# EAGLE design AVR-Doper (EAGLE 4.16)
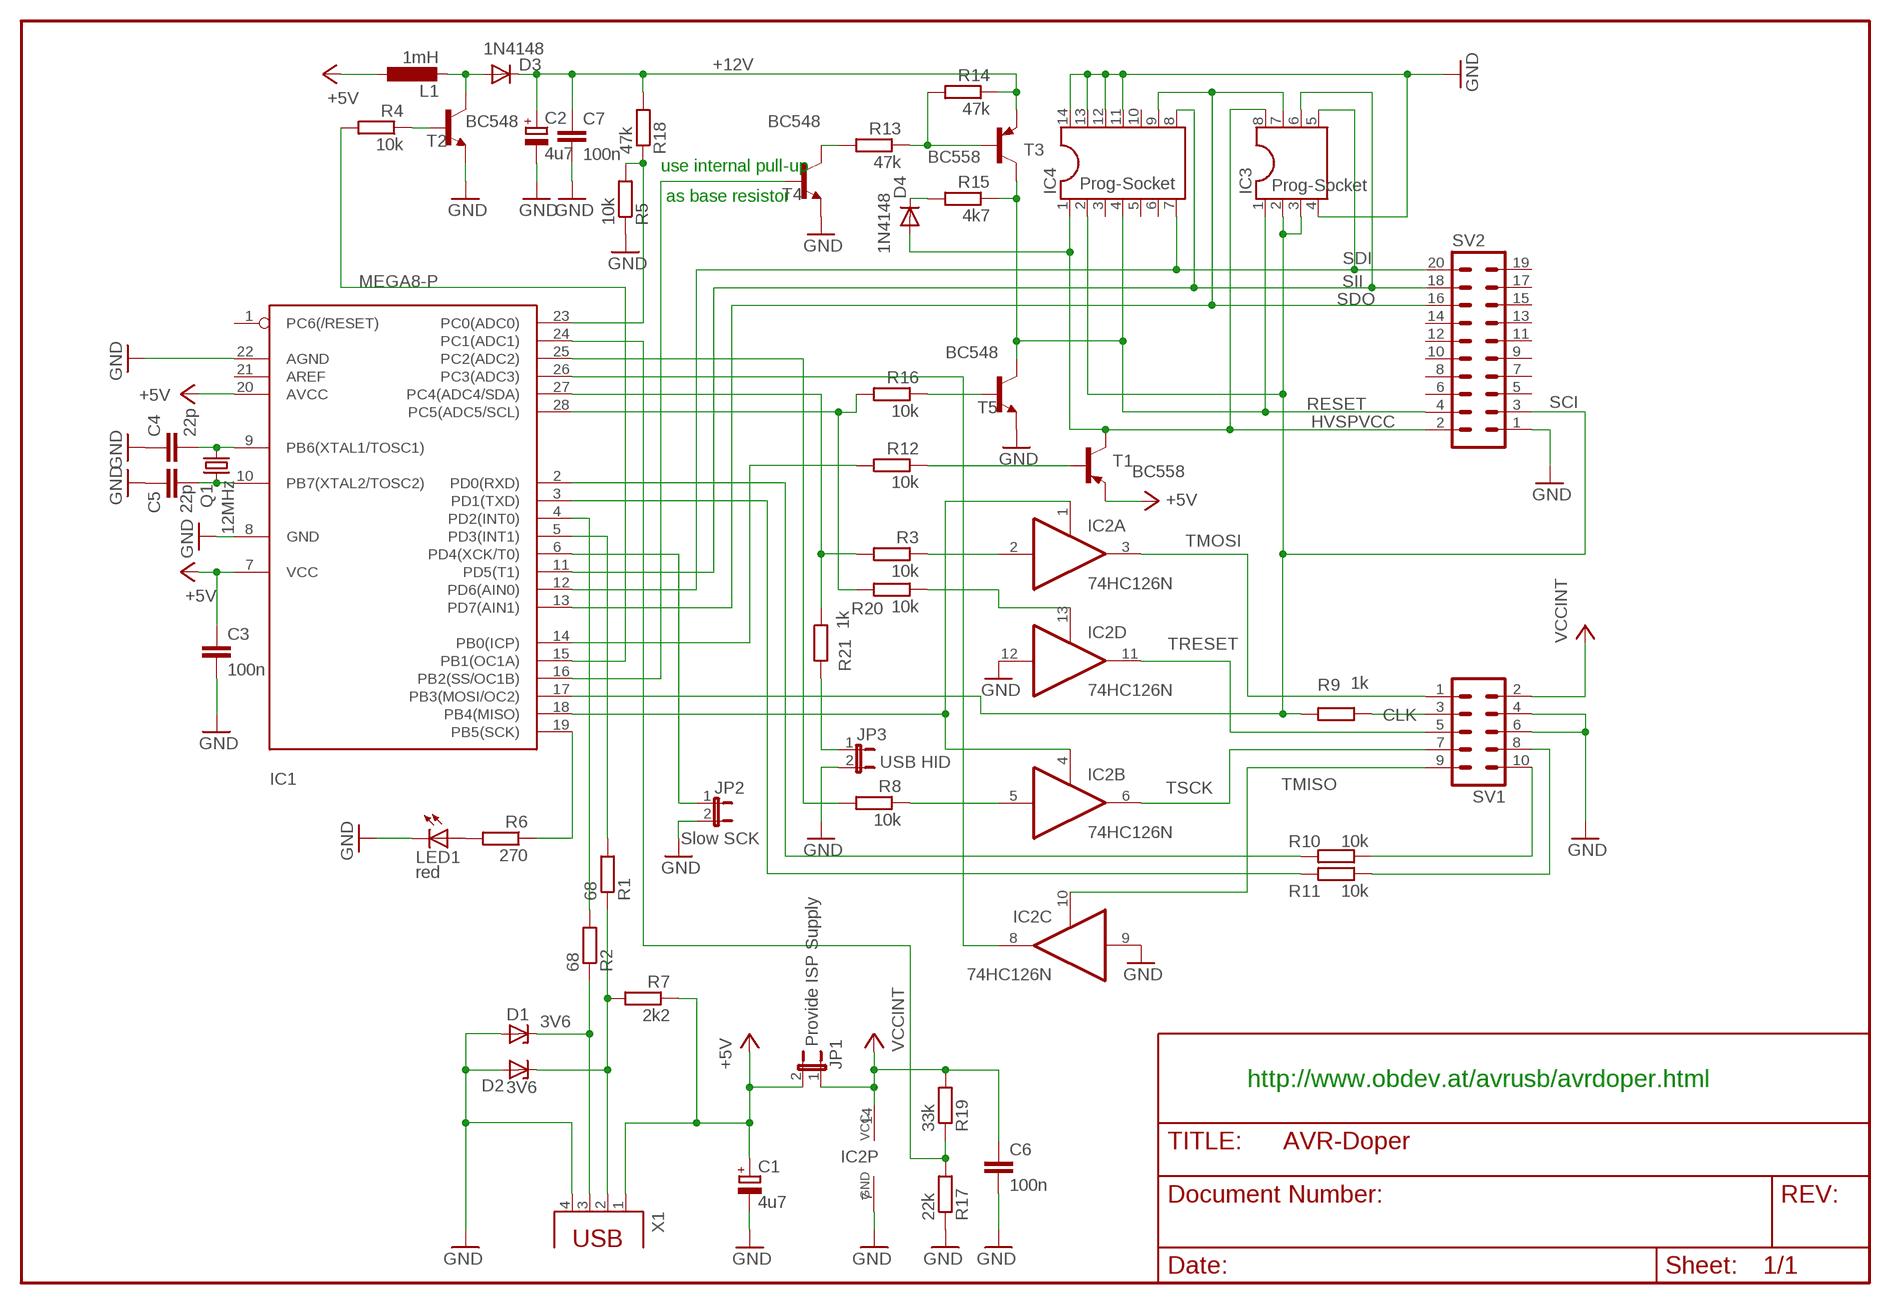
[diagram p0: schematic, sheet 1]

## Parts
C1  4u7  CPOL-EUE2.5-5  [E2,5-5]
C2  4u7  CPOL-EUE2.5-5  [E2,5-5]
C3  100n  C-EU025-024X044  [C025-024X044]
C4  22p  C-EU025-024X044  [C025-024X044]
C5  22p  C-EU025-024X044  [C025-024X044]
C6  100n  C-EU025-024X044  [C025-024X044]
C7  100n  C-EU025-024X044  [C025-024X044]
D1  3V6  ZENER-DIODEDO34-7  [DO34Z7]
D2  3V6  ZENER-DIODEDO34-7  [DO34Z7]
D3  1N4148  1N41487MM  [DO35-7]
D4  1N4148  1N41487MM  [DO35-7]
IC1  MEGA8-P  [DIL28-3]
IC2  74HC126N  [DIL14]
IC3  Prog-Socket  DIL8S  [SOCKED-08]
IC4  Prog-Socket  DIL14S  [SOCKED-14]
JP1  Provide ISP Supply  JP1E  [JP1]
JP2  Slow SCK  JP1E  [JP1]
JP3  USB HID  JP1E  [JP1]
L1  1mH  L-EU0207/12  [0207/12]
LED1  red  LED3MM  [LED3MM]
Q1  12MHz  CRYTALHC49S  [HC49/S]
R1  68  R-EU_0207/10  [0207/10]
R2  68  R-EU_0207/10  [0207/10]
R3  10k  R-EU_0207/10  [0207/10]
R4  10k  R-EU_0207/10  [0207/10]
R5  10k  R-EU_0207/10  [0207/10]
R6  270  R-EU_0207/10  [0207/10]
R7  2k2  R-EU_0207/10  [0207/10]
R8  10k  R-EU_0207/10  [0207/10]
R9  1k  R-EU_0207/10  [0207/10]
R10  10k  R-EU_0207/10  [0207/10]
R11  10k  R-EU_0207/10  [0207/10]
R12  10k  R-EU_0207/10  [0207/10]
R13  47k  R-EU_0207/10  [0207/10]
R14  47k  R-EU_0207/10  [0207/10]
R15  4k7  R-EU_0207/10  [0207/10]
R16  10k  R-EU_0207/10  [0207/10]
R17  22k  R-EU_0207/10  [0207/10]
R18  47k  R-EU_0207/10  [0207/10]
R19  33k  R-EU_0207/10  [0207/10]
R20  10k  R-EU_0207/10  [0207/10]
R21  1k  R-EU_0207/10  [0207/10]
SV1  ML10L  [ML10L]
SV2  ML20L  [ML20L]
T1  BC558  -PNP-TO92/  [TO92/]
T2  BC548  2N930-NPN-TO18-EBC  [TO18]
T3  BC558  -PNP-TO92/  [TO92/]
T4  BC548  2N930-NPN-TO18-EBC  [TO18]
T5  BC548  2N930-NPN-TO18-EBC  [TO18]
X1  PN61729  [PN61729]

## Nets
+5V: C1.+ C3.1 IC1.7(VCC) IC1.20(AVCC) JP1.2 L1.1 R7.1 T1.1(E) X1.1
+12V: C2.+ C7.1 D3.C R14.1 R18.2 T3.1(E)
CLK: R9.1 SV1.3
GND: C1.- C2.- C3.2 C4.1 C5.1 C6.2 C7.2 D1.A D2.A IC1.8(GND) IC1.22(AGND) IC2.7(P:GND) IC2.9(C:I) IC2.12(D:I) IC3.4 IC4.11 IC4.12 IC4.13 IC4.14 JP2.2 JP3.2 LED1.K(C) R5.1 R17.1 SV1.4 SV1.6 SV2.1 T2.1(E) T4.1(E) T5.1(E) X1.4
HVSPVCC: D4.A IC3.8 IC4.1 SV2.2 T1.3(C)
N$1: IC1.18(PB4(MISO)) IC2.1(A:OE) IC2.4(B:OE)
N$2: IC2.2(A:I) R3.1
N$3: IC2.5(B:I) R8.1
N$4: IC1.27(PC4(ADC4/SDA)) R3.2 R21.1
N$5: D2.C R1.1 R7.2 X1.2
N$6: IC1.25(PC2(ADC2)) R8.2
N$7: IC1.4(PD2(INT0)) R2.2
N$8: D1.C R2.1 X1.3
N$9: IC1.28(PC5(ADC5/SCL)) R16.2 R20.2
N$10: IC1.26(PC3(ADC3)) IC2.8(C:O)
N$11: IC1.24(PC1(ADC1)) R17.2 R19.1
N$12: R10.1 SV1.10
N$13: IC1.2(PD0(RXD)) R10.2
N$14: IC1.3(PD1(TXD)) R11.2
N$15: R11.1 SV1.8
N$18: R12.1 T1.2(B)
N$19: IC1.14(PB0(ICP)) R12.2
N$20: IC2.13(D:OE) R20.1
N$21: IC1.5(PD3(INT1)) R1.2
N$22: C4.2 IC1.9(PB6(XTAL1/TOSC1)) Q1.2
N$23: C5.2 IC1.10(PB7(XTAL2/TOSC2)) Q1.1
N$25: LED1.A R6.2
N$26: IC1.15(PB1(OC1A)) R4.2
N$27: D3.A L1.2 T2.3(C)
N$29: R4.1 T2.2(B)
N$30: R13.2 T4.3(C)
N$31: R13.1 R14.2 T3.2(B)
N$32: JP3.1 R21.2
N$33: IC1.23(PC0(ADC0)) R5.2 R18.1
N$34: D4.C R15.2
N$35: R16.1 T5.2(B)
N$37: IC1.16(PB2(SS/OC1B)) T4.2(B)
N$38: IC1.6(PD4(XCK/T0)) JP2.1
N$39: IC1.19(PB5(SCK)) R6.1
RESET: IC3.1 IC4.4 R15.1 SV2.4 T3.3(C) T5.3(C)
SCI: IC1.17(PB3(MOSI/OC2)) IC3.2 IC3.3 IC4.2 R9.2 SV2.3
SDI: IC1.12(PD6(AIN0)) IC3.5 IC4.7 SV2.20
SDO: IC1.13(PD7(AIN1)) IC3.7 IC4.9 SV2.16
SII: IC1.11(PD5(T1)) IC3.6 IC4.8 SV2.18
TMISO: IC2.10(C:OE) SV1.9
TMOSI: IC2.3(A:O) SV1.1
TRESET: IC2.11(D:O) SV1.5
TSCK: IC2.6(B:O) SV1.7
VCCINT: C6.1 IC2.14(P:VCC) JP1.1 R19.2 SV1.2
Unconnected: IC1.1(PC6(/RESET)) IC1.21(AREF) IC4.3 IC4.5 IC4.6 IC4.10 SV2.5 SV2.6 SV2.7 SV2.8 SV2.9 SV2.10 SV2.11 SV2.12 SV2.13 SV2.14 SV2.15 SV2.17 SV2.19

## Notes on the sheet
- use internal pull-up
- as base resistor
- http://www.obdev.at/avrusb/avrdoper.html

## Library data of the parts
C1 C2 = rcl:CPOL-EU: POLARIZED CAPACITOR, European symbol
C3-C7 = rcl:C-EU: CAPACITOR, European symbol
D1 D2 = diode:ZENER-DIODE: Z-Diode
D3 D4 = diode:1N4148: DIODE high speed (Philips)
IC1 = atmel:MEGA8-P: MICROCONTROLLER 8 Kbytes FLASH 1 kbytes SRAM 512 bytes EEPROM USART 4-channel 10 bit ADC 2-channel 8 bit ADC Source: avr.lbr
IC2 = 74xx-eu:74*126: Quad bus BUFFER, 3-state
IC3 = ic-package:DIL8: Dual In Line
IC4 = ic-package:DIL14: Dual In Line
JP1-JP3 = jumper:JP1E: JUMPER
L1 = rcl:L-EU: INDUCTOR, European symbol
LED1 = led:LED: LED OSRAM: - CHIPLED LG R971, LG N971, LY N971, LG Q971, LY Q971, LO R971, LY R971 LH N974, LH R974 LS Q976, LO Q976, LY Q976 LO Q996 - Hyper CHIPLED LW Q18S LB Q993, LB Q99A, LB R99A - SideLED LS A670, LO A670, LY A670, LG A670, LP A670 LB A673, LV A673, LT A673, LW A673 LH A674 LY A675 LS A676, LA A676, LO A676, LY A676, LW A676 LS A679, LY A679, LG A679 - Hyper Micro SIDELED® LS Y876, LA Y876, LO Y876, LY Y876 LT Y87S - SmartLED LW L88C, LW L88S LB L89C, LB L89S, LG L890 LS L89K, LO L89K, LY L89K LS L896, LA L896, LO L896, LY L896 - TOPLED LS T670, LO T670, LY T670, LG T670, LP T670 LSG T670, LSP T670, LSY T670, LOP T670, LYG T670 LG T671, LOG T671, LSG T671 LB T673, LV T673, LT T673, LW T673 LH T674 LS T676, LA T676, LO T676, LY T676, LB T676, LH T676, LSB T676, LW T676 LB T67C, LV T67C, LT T67C, LS T67K, LO T67K, LY T67K, LW E67C LS E67B, LA E67B, LO E67B, LY E67B, LB E67C, LV E67C, LT E67C LW T67C LS T679, LY T679, LG T679 LS T770, LO T770, LY T770, LG T770, LP T770 LB T773, LV T773, LT T773, LW T773 LH T774 LS E675, LA E675, LY E675, LS T675 LS T776, LA T776, LO T776, LY T776, LB T776 LHGB T686 LT T68C, LB T68C - Hyper Mini TOPLED® LB M676 - Mini TOPLED Santana® LG M470 LS M47K, LO M47K, LY M47K Source: http://www.osram.convergy.de/
Q1 = crystal:CRYTAL: CRYSTAL
R1-R21 = rcl:R-EU_: RESISTOR, European symbol
SV1 = con-harting-ml:ML10: HARTING
SV2 = con-harting-ml:ML20: HARTING
T1 T3 = transistor:*-PNP-: PNP Transistror
T2 T4 T5 = transistor:*-NPN-: NPN Transistror
X1 = con-berg:PN61729: BERG USB connector

## Board
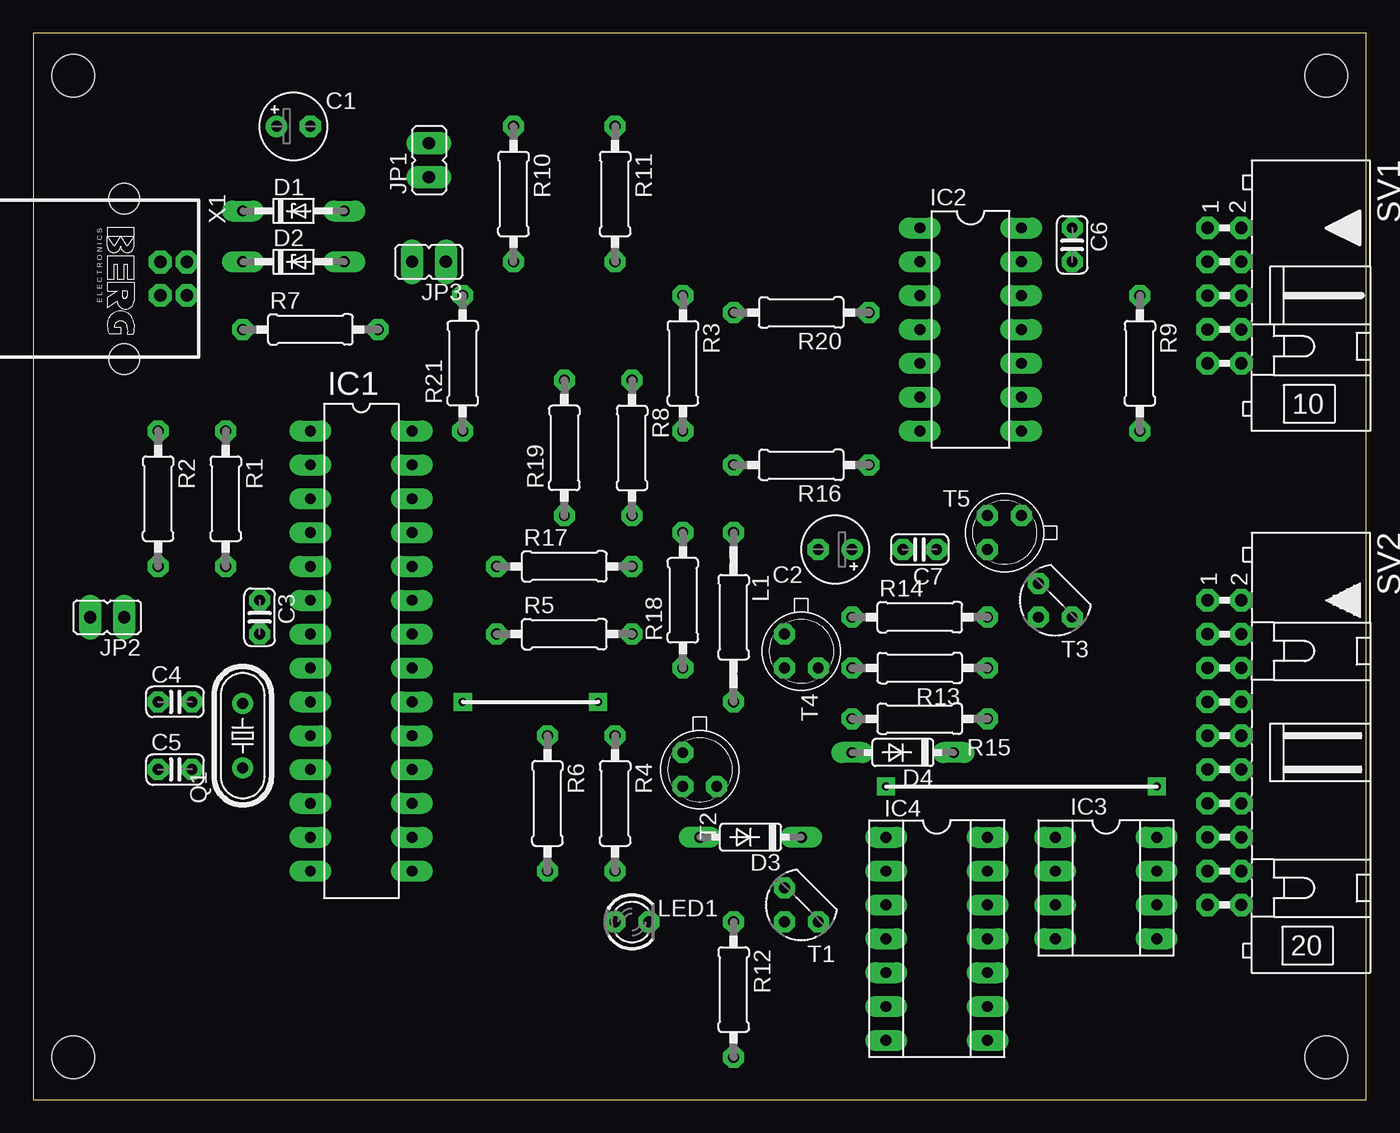
[diagram p1: board, top side]
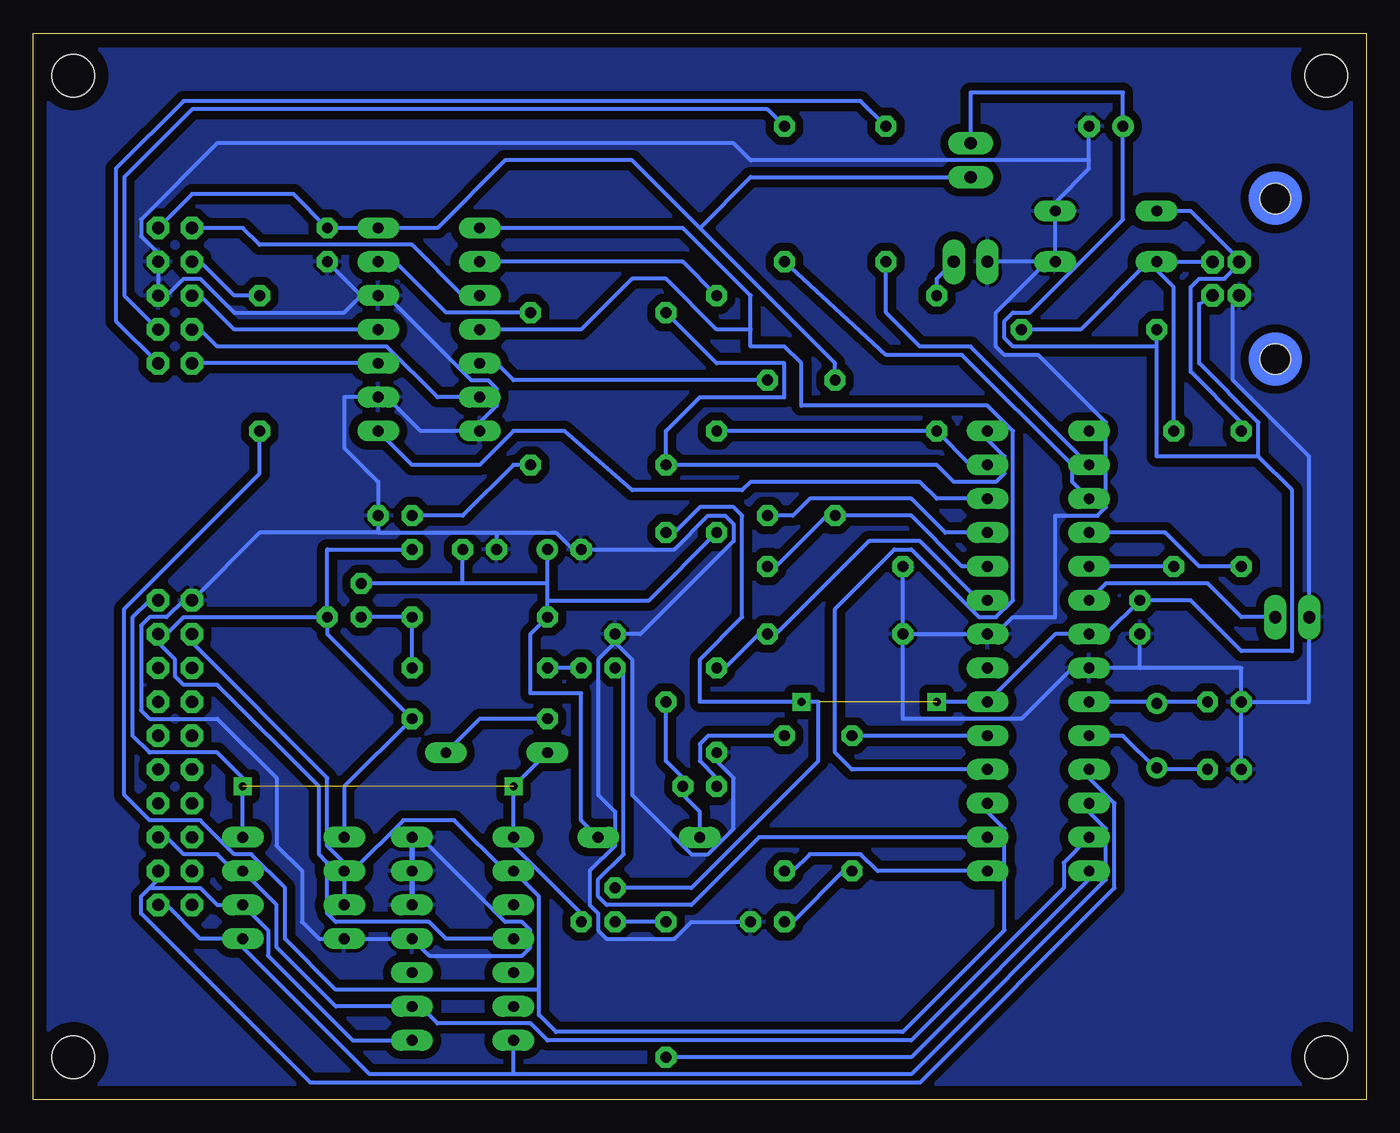
[diagram p2: board, bottom side, seen from below]

Size 100 x 80 mm. Coordinates in mm from the lower left corner, seen from the top.
Outline: 0,0 100,0 100,80 0,80 0,0
Copper layers 16: Bottom 0.035mm
Design rules "default": minimum track width 12mil, minimum drill 31mil, track to track 8mil, track to pad 8mil, pad to pad 8mil, via to via 8mil, smd to smd 8mil, copper to edge 40mil, drill to drill 8mil, minimum pad ring 15mil, minimum via ring 15mil, stop-mask expansion 4mil, vias tented up to drill 0mil, thermal gap 10mil
Holes 3.2 mm at 3.01,76.83 3.01,3.17 96.99,3.17 96.99,76.83

### Footprints (pad centres in the part's own frame; a part is rotated, then mirrored left to right if it is on the bottom)
E2,5-5 = drill 0.813 pad 1.6 round: + -1.27,0 | drill 0.813 pad 1.6 octagon: - 1.27,0
C025-024X044 = drill 0.813 octagon: 1 -1.27,0; 2 1.27,0
DO34Z7 = drill 0.813 long: A 3.81,0; C -3.81,0
DO35-7 = drill 0.813 long: A 3.81,0; C -3.81,0
DIL28-3 = drill 0.813 long: 1 -16.51,-3.81; 2 -13.97,-3.81; 3 -11.43,-3.81; 4 -8.89,-3.81; 5 -6.35,-3.81; 6 -3.81,-3.81; 7 -1.27,-3.81; 8 1.27,-3.81; 9 3.81,-3.81; 10 6.35,-3.81; 11 8.89,-3.81; 12 11.43,-3.81; 13 13.97,-3.81; 14 16.51,-3.81; 15 16.51,3.81; 16 13.97,3.81; 17 11.43,3.81; 18 8.89,3.81; 19 6.35,3.81; 20 3.81,3.81; 21 1.27,3.81; 22 -1.27,3.81; 23 -3.81,3.81; 24 -6.35,3.81; 25 -8.89,3.81; 26 -11.43,3.81; 27 -13.97,3.81; 28 -16.51,3.81
DIL14 = drill 0.813 long: 1 -7.62,-3.81; 2 -5.08,-3.81; 3 -2.54,-3.81; 4 0,-3.81; 5 2.54,-3.81; 6 5.08,-3.81; 7 7.62,-3.81; 8 7.62,3.81; 9 5.08,3.81; 10 2.54,3.81; 11 0,3.81; 12 -2.54,3.81; 13 -5.08,3.81; 14 -7.62,3.81
SOCKED-08 = drill 0.813 long: 1 -3.81,-3.81; 2 -1.27,-3.81; 3 1.27,-3.81; 4 3.81,-3.81; 5 3.81,3.81; 6 1.27,3.81; 7 -1.27,3.81; 8 -3.81,3.81
SOCKED-14 = drill 0.813 long: 1 -7.62,-3.81; 2 -5.08,-3.81; 3 -2.54,-3.81; 4 0,-3.81; 5 2.54,-3.81; 6 5.08,-3.81; 7 7.62,-3.81; 8 7.62,3.81; 9 5.08,3.81; 10 2.54,3.81; 11 0,3.81; 12 -2.54,3.81; 13 -5.08,3.81; 14 -7.62,3.81
JP1 = drill 0.914 long: 1 0,-1.27; 2 0,1.27
0207/12 = drill 0.813 octagon: 1 -6.35,0; 2 6.35,0
LED3MM = drill 0.813 octagon: A -1.27,0; K 1.27,0
HC49/S = drill 0.813 round: 1 -2.413,0; 2 2.413,0
0207/10 = drill 0.813 octagon: 1 -5.08,0; 2 5.08,0
ML10L = drill 0.914 octagon: 1 -5.08,-1.27; 2 -5.08,1.27; 3 -2.54,-1.27; 4 -2.54,1.27; 5 0,-1.27; 6 0,1.27; 7 2.54,-1.27; 8 2.54,1.27; 9 5.08,-1.27; 10 5.08,1.27
ML20L = drill 0.914 octagon: 1 -11.43,-1.27; 2 -11.43,1.27; 3 -8.89,-1.27; 4 -8.89,1.27; 5 -6.35,-1.27; 6 -6.35,1.27; 7 -3.81,-1.27; 8 -3.81,1.27; 9 -1.27,-1.27; 10 -1.27,1.27; 11 1.27,-1.27; 12 1.27,1.27; 13 3.81,-1.27; 14 3.81,1.27; 15 6.35,-1.27; 16 6.35,1.27; 17 8.89,-1.27; 18 8.89,1.27; 19 11.43,-1.27; 20 11.43,1.27
TO92/ = drill 0.813 octagon: 1 1.27,-1.27; 2 1.27,1.27; 3 -1.27,1.27
TO18 = drill 0.813 octagon: 1 -1.27,-1.27; 2 1.27,-1.27; 3 1.27,1.27
PN61729 = drill 0.95 octagon: 1 1.25,4.71; 2 -1.25,4.71; 3 -1.25,2.71; 4 1.25,2.71 | hole 2.3: -6.02,0; 6.02,0

### Placement (x,y rotation side)
C1  19.52,73.02 0 top
C2  60.16,41.27 180 top
C3  16.98,36.19 270 top
C4  10.63,29.84 0 top
C5  10.63,24.76 0 top
C6  77.94,64.13 270 top
C7  66.51,41.27 180 top
D1  19.52,66.67 0 top
D2  19.52,62.86 0 top
D3  53.81,19.68 180 top
D4  65.24,26.03 180 top
IC1  24.6,33.65 270 top
IC2  70.32,57.78 270 top
IC3  80.48,15.87 270 top
IC4  67.78,12.06 270 top
JP1  29.68,70.48 0 top
JP2  5.55,36.19 90 top
JP3  29.68,62.86 90 top
L1  52.54,36.19 270 top
LED1  44.92,13.33 0 top
Q1  15.71,27.3 90 top
R1  14.44,45.08 270 top
R2  9.36,45.08 270 top
R3  48.73,55.24 270 top
R4  43.65,22.22 270 top
R5  39.84,34.92 0 top
R6  38.57,22.22 270 top
R7  20.79,57.78 0 top
R8  44.92,48.89 270 top
R9  83.02,55.24 270 top
R10  36.03,67.94 270 top
R11  43.65,67.94 270 top
R12  52.54,8.25 270 top
R13  66.51,32.38 180 top
R14  66.51,36.19 0 top
R15  66.51,28.57 180 top
R16  57.62,47.62 180 top
R17  39.84,40 0 top
R18  48.73,37.46 90 top
R19  39.84,48.89 90 top
R20  57.62,59.05 180 top
R21  32.22,55.24 90 top
SV1  89.37,60.32 270 top
SV2  89.37,26.03 270 top
T1  57.62,14.6 180 top
T2  50,24.76 270 top
T3  76.67,37.46 180 top
T4  57.62,33.65 270 top
T5  72.86,42.54 180 top
X1  6.82,61.59 270 top

### Tracks (layer width: path | path; a pad name or v marks a point on that pad's centre or on a via)
+5V  (via drill 0.6)  (1 unrouted)
  Bottom 0.305: T1.1 50.63,15.87 41.11,25.39 41.11,29.84 v42.38,29.84 50,29.84 50,33.02 46.82,36.19 46.82,43.81 47.46,44.45 50,44.45 51.91,42.54 L1.1 | 15.71,56.51 15.71,48.26 8.09,48.26 | 15.71,56.51 26.5,56.51 27.14,57.15 27.14,58.41 26.5,59.05 25.23,59.05 18.25,66.03 C1.+ 18.25,75.56 29.68,75.56 JP1.2 | X1.1 12.54,59.69 12.54,55.24 8.09,50.8 8.09,48.26 | 8.09,48.26 5.55,45.72 5.55,33.65 9.36,33.65 13.17,37.46 C3.1 19.52,34.92 IC1.7 23.33,34.92 IC1.20 32.22,29.84 | 15.71,56.51 R7.1
+12V
  Bottom 0.305: R18.2 53.81,37.46 61.43,37.46 | 61.43,37.46 R14.1 62.7,34.92 62.7,30.47 58.89,30.47 58.89,20.95 D3.C | 61.43,37.46 61.43,38.73 | 61.43,38.73 C2.+ | 61.43,38.73 67.78,38.73 | 67.78,38.73 T3.1 | 67.78,38.73 C7.1
CLK
  Bottom 0.305: R9.1 84.92,60.32 87.47,62.86 SV1.3
GND
  Bottom 0.305: R5.1 IC1.22 27.77,34.92 26.5,36.19 23.33,36.19 23.33,43.81 20.15,43.81 19.52,44.45 19.52,50.8 24.6,55.88 27.14,55.88 27.77,56.51 27.77,59.05 23.96,62.86 D2.A | R5.1 R17.1 | D2.A D1.A 23.33,67.3 20.79,69.84 20.79,70.48 | 20.79,70.48 C1.- | C5.1 C4.1 | C4.1 9.36,32.38 16.98,32.38 | 16.98,32.38 IC1.8 22.06,32.38 25.87,28.57 34.76,28.57 R5.1 | X1.4 10,59.69 10,53.97 4.28,48.26 JP2.2 4.28,29.84 C4.1 | 56.35,34.29 57.62,33.02 57.62,22.86 56.35,21.58 56.35,19.04 58.25,17.14 58.25,14.6 57.62,13.97 57.62,12.7 56.98,12.06 51.91,12.06 50.63,13.33 LED1.K | 56.35,34.29 55.08,33.02 55.08,22.86 50.63,18.41 49.37,18.41 47.46,20.31 47.46,24.12 48.73,25.39 T2.1 | 56.35,34.29 T4.1 54.45,34.92 47.46,41.91 47.46,43.18 48.09,43.81 49.37,43.81 51.91,41.27 C2.- 59.52,41.27 60.8,42.54 65.24,42.54 | IC4.14 70.95,19.68 64.61,13.33 63.34,13.33 62.7,12.7 62.7,11.43 63.34,10.79 70.32,10.79 IC4.11 IC3.4 | IC3.4 76.03,12.06 | 74.13,42.54 65.24,42.54 | 74.13,42.54 T5.1 74.13,46.35 76.67,48.89 76.67,52.7 IC2.9 73.5,52.7 70.95,50.16 IC2.7 66.51,50.8 65.24,52.07 65.24,53.34 65.88,53.97 67.14,53.97 73.5,60.32 IC2.12 75.4,60.32 | 20.79,70.48 46.19,70.48 47.46,71.75 86.19,71.75 91.91,66.03 91.91,64.77 90.64,63.5 SV1.4 SV1.6 90,60.32 88.73,61.59 87.47,61.59 84.92,59.05 76.67,59.05 75.4,60.32 | 75.4,60.32 C6.2 | 16.98,32.38 C3.2 | 74.13,42.54 83.02,42.54 SV2.1 88.73,37.46 90,36.19 91.28,36.19 91.91,35.55 91.91,29.2 91.28,28.57 86.19,28.57 81.75,24.12 81.75,19.04 79.84,17.14 79.84,13.33 78.58,12.06 IC3.4 | 65.24,42.54 C7.2 | D2.A JP3.2
  Bottom 0.406: IC4.14 IC4.13 IC4.12
  pour Bottom (isolate 0.61): 0.47,79.37 99.53,79.37 99.53,0.63 0.47,0.63
HVSPVCC  (via drill 0.6)  (1 unrouted)
  Bottom 0.305: T1.3 58.89,13.97 63.97,19.04 IC4.1 63.97,23.49 D4.A | IC3.8 v84.29,23.49 84.29,24.12 86.19,26.03 91.28,26.03 92.55,27.3 92.55,36.19 91.28,37.46 SV2.2
N$1
  Bottom 0.305: 65.88,57.78 IC2.4 58.89,57.78 55.08,61.59 52.54,61.59 48.73,57.78 46.19,57.78 | IC2.1 51.27,65.4 46.19,60.32 46.19,57.78 | 46.19,57.78 46.19,56.51 43.65,56.51 42.38,55.24 42.38,52.07 28.41,52.07 26.5,50.16 26.5,37.46 27.77,36.19 29.04,36.19 34.12,41.27 35.39,41.27 39.84,36.83 39.84,26.03 38.57,24.76 IC1.18
N$2
  Bottom 0.305: R3.1 51.27,62.86 IC2.2
N$3
  Bottom 0.305: R8.1 63.97,53.97 65.24,55.24 IC2.5
N$4
  Bottom 0.305: IC1.27 29.68,47.62 R21.1 R3.2
N$5
  Bottom 0.305: R1.1 14.44,60.96 15.71,62.23 D2.C | R7.2 21.42,57.78 16.34,62.86 D2.C | X1.2 11.9,62.86 D2.C
N$6
  Bottom 0.305: IC1.25 31.58,42.54 34.12,45.08 41.74,45.08 43.02,43.81 R8.2
N$7
  Bottom 0.305: R2.2 12.54,40 15.08,42.54 IC1.4
N$8
  Bottom 0.305: R2.1 9.36,50.8 13.17,54.61 13.17,60.96 12.54,61.59 10.63,61.59 10,62.23 X1.3 10,63.5 13.17,66.67 D1.C
N$9
  Bottom 0.305: IC1.28 28.41,49.53 27.14,48.26 27.14,46.98 27.77,46.35 30.95,46.35 32.22,47.62 R16.2 52.54,50.16 50,52.7 43.65,52.7 43.65,55.24 48.73,55.24 R20.2
N$10
  Bottom 0.305: IC1.26 32.22,45.08 33.49,46.35 46.19,46.35 46.82,45.72 55.08,45.72 60.16,50.16 63.97,50.16 66.51,47.62 71.59,47.62 IC2.8
N$11
  Bottom 0.305: IC1.24 30.31,40 34.12,43.81 R19.1 40.48,43.81 44.28,40 R17.2
N$12
  Bottom 0.305: R10.1 37.94,74.92 88.73,74.92 93.81,69.84 93.81,58.41 SV1.10
N$13
  Bottom 0.305: IC1.2 29.68,56.51 33.49,56.51 36.03,59.05 R10.2
N$14
  Bottom 0.305: IC1.3 22.06,46.35 22.06,47.62 30.31,55.88 36.03,55.88 R11.2
N$15
  Bottom 0.305: R11.1 44.92,74.29 88.1,74.29 93.18,69.21 93.18,60.32 SV1.8
N$17  (via drill 0.6)
  other vias: 32.22,29.84
N$18
  Bottom 0.305: R12.1 T1.2
N$19
  Bottom 0.305: R12.2 34.12,3.17 20.79,16.5 IC1.14
N$20
  Bottom 0.305: R20.1 69.05,59.05 72.86,62.86
  Bottom 0.406: 72.86,62.86 IC2.13
N$21
  Bottom 0.305: R1.2 IC1.5
N$22
  Bottom 0.305: C4.2 15.08,29.84 Q1.2 16.34,29.84 IC1.9
N$23
  Bottom 0.305: IC1.10 18.25,27.3 15.71,24.76 | 15.71,24.76 Q1.1 | C5.2 15.71,24.76
N$24  (via drill 0.6)
  other vias: 63.97,23.49
N$25
  Bottom 0.305: R6.2 39.2,17.14 43.02,13.33 LED1.A
N$26
  Bottom 0.305: IC1.15 36.66,17.14 37.94,18.41 41.74,18.41 43.02,17.14 R4.2
N$27
  Bottom 0.305: D3.A 50,21.58 51.27,22.86 T2.3 51.27,24.12 52.54,25.39 L1.2
N$28
  pour Bottom (isolate 0.61): 0.47,79.37 99.53,79.37 99.53,0.63 0.47,0.63
N$29
  Bottom 0.305: R4.1 49.37,27.3 50,26.66 50,25.39 48.73,24.12 T2.2
N$30
  Bottom 0.305: T4.3 R13.2
N$31
  Bottom 0.305: R13.1 R14.2 T3.2
N$32
  Bottom 0.305: R21.2 32.22,61.59 JP3.1
N$33
  Bottom 0.305: IC1.23 29.04,37.46 33.49,41.91 37.3,41.91 44.28,34.92 R5.2 45.55,34.92 48.09,32.38 R18.1
N$34
  Bottom 0.305: R15.2 66.51,28.57 D4.C
N$35
  Bottom 0.305: T5.2 67.78,43.81 63.97,47.62 R16.1
N$37
  Bottom 0.305: IC1.16 45.55,19.68 50.63,14.6 56.98,14.6 57.62,15.24 57.62,16.5 55.71,18.41 55.71,32.38 T4.2
N$38
  Bottom 0.305: IC1.6 19.52,38.73 11.9,38.73 9.36,36.19 JP2.1
N$39
  Bottom 0.305: IC1.19 R6.1
RESET
  Bottom 0.305: T5.3 77.94,41.27 T3.3 | T3.3 88.73,36.19 90,34.92 SV2.4 90.64,34.29 89.37,33.02 89.37,31.74 88.73,31.11 86.19,31.11 78.58,23.49 78.58,18.41 77.94,17.77 77.94,13.97 77.3,13.33 70.32,13.33 69.05,12.06 IC4.4 | T3.3 77.94,34.92 R15.1 76.67,23.49 IC3.1
SCI
  Bottom 0.305: 62.06,8.25 62.06,6.34 60.8,5.08 34.76,5.08 27.14,12.7 27.14,20.31 28.41,21.58 IC1.17 | IC3.2 76.03,17.14 72.22,20.95 68.41,20.95 64.61,17.14 IC4.2 62.06,15.24 62.06,8.25 | 62.06,8.25 77.3,8.25 81.11,12.06 81.11,15.87 83.66,18.41 84.92,18.41 87.47,20.95 91.28,20.95 93.18,22.86 93.18,36.83 83.02,46.98 R9.2 | SV2.3 88.1,34.29 77.94,24.12 77.94,19.04 76.67,17.77 IC3.2 | IC3.2 IC3.3
SDI
  Bottom 0.305: SV2.20 90,14.6 87.47,12.06 IC3.5 84.29,11.43 74.77,1.9 63.97,1.9 | 63.97,1.9 34.12,1.9 19.52,16.5 19.52,20.31 20.79,21.58 IC1.12 | 63.97,1.9 IC4.7
SDO
  Bottom 0.305: IC1.13 22.7,17.77 22.7,15.87 34.12,4.44 61.43,4.44 62.7,5.71 69.69,5.71 70.95,6.98 IC4.9 77.3,6.98 81.75,11.43 81.75,14.6 IC3.7 84.92,17.14 86.19,18.41 88.73,18.41 90,19.68 SV2.16
SII
  Bottom 0.305: IC4.8 76.03,4.44 82.39,10.79 82.39,12.7 IC3.6 86.19,14.6 87.47,15.87 91.28,15.87 | 91.28,15.87 90.64,16.5 SV2.18 | 91.28,15.87 91.91,15.24 91.91,13.97 79.21,1.27 33.49,1.27 18.88,15.87 18.88,22.22 20.79,24.12 IC1.11
TMISO
  Bottom 0.305: IC2.10 SV1.9
TMOSI
  Bottom 0.305: IC2.3 67.78,60.32 71.59,64.13 83.02,64.13 84.29,65.4 SV1.1
TRESET
  Bottom 0.305: IC2.11 84.92,57.78 87.47,60.32 SV1.5
TSCK
  Bottom 0.305: IC2.6 69.69,52.7 73.5,56.51 86.19,56.51 87.47,57.78 SV1.7
VCCINT
  Bottom 0.305: 50,65.4 39.84,55.24 R19.2 | 50,65.4 55.08,70.48 64.61,70.48 69.69,65.4 IC2.14 C6.1 80.48,67.94 88.1,67.94 SV1.2 | JP1.1 46.19,69.21 50,65.4
(copper drawn outside any net)
  shapes: Bottom circle x2